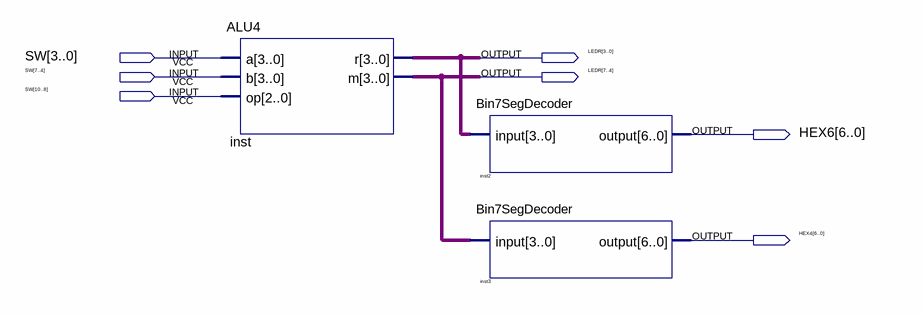
[diagram p0: schematic sheet]
// Quartus schematic ALUDemo.bdf as structural Verilog: 3 symbols, 7 pins
module ALUDemo (
  input  [10:0] SW,
  output [7:0] LEDR,
  output [6:0] HEX6,
  output [6:0] HEX4
);

  ALU4 inst (.a(SW[3:0]), .b(SW[7:4]), .op(SW[10:8]), .r(LEDR[3:0]), .m(LEDR[7:4]));
  Bin7SegDecoder inst2 (.\input (LEDR[3:0]), .\output (HEX6));
  Bin7SegDecoder inst3 (.\input (LEDR[7:4]), .\output (HEX4));
endmodule
